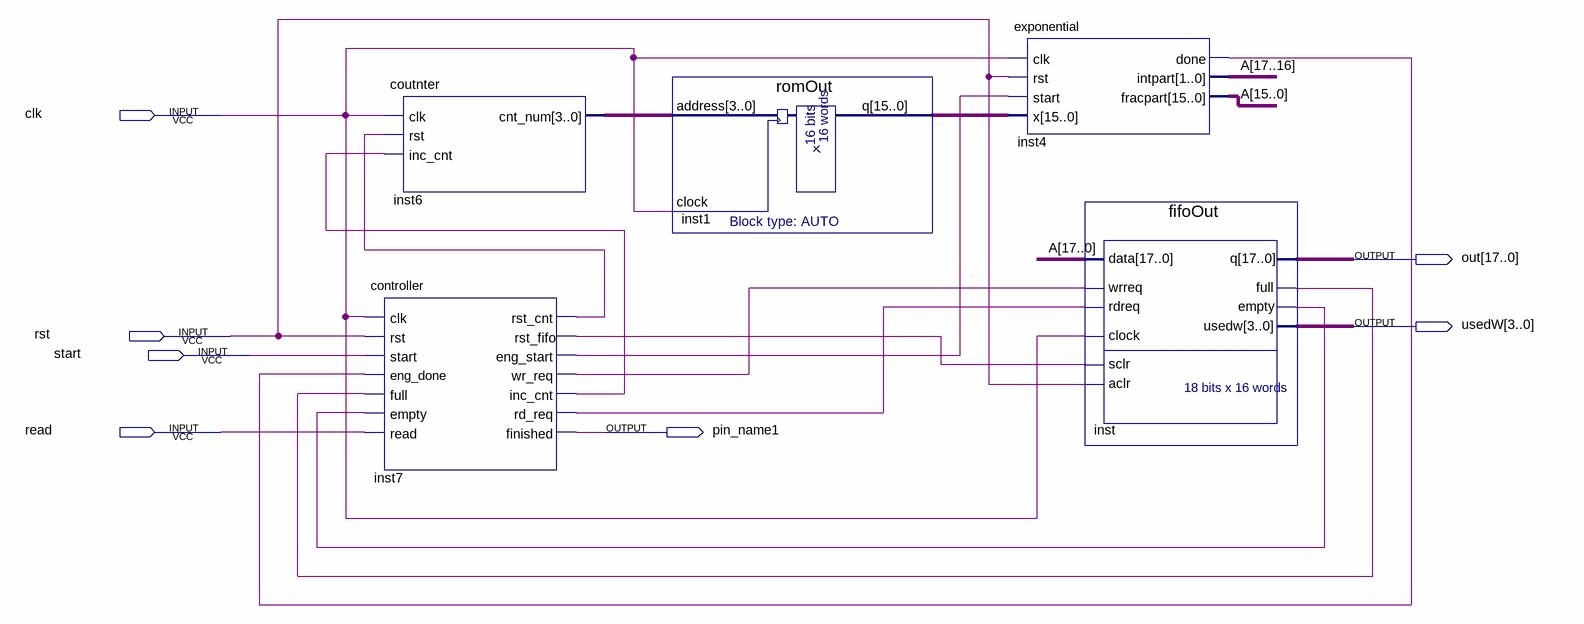
[diagram p0: schematic sheet]
// Quartus schematic exp.bdf as structural Verilog: 5 symbols, 7 pins
module exp (
  input  clk,
  input  rst,
  input  start,
  input  read,
  output [17:0] out,
  output [3:0] usedW,
  output pin_name1
);

  wire inst4_done, inst7_eng_start, inst7_inc_cnt, inst7_rd_req, inst7_rst_cnt, inst7_rst_fifo, inst7_wr_req,
       inst_empty, inst_full;
  wire [3:0] inst6_cnt_num;
  wire [15:0] inst1_q;
  wire [17:0] A;

  controller inst7 (
    .clk(clk), .rst(rst), .start(start), .eng_done(inst4_done), .full(inst_full), .empty(inst_empty),
    .read(read), .rst_cnt(inst7_rst_cnt), .rst_fifo(inst7_rst_fifo), .eng_start(inst7_eng_start),
    .wr_req(inst7_wr_req), .inc_cnt(inst7_inc_cnt), .rd_req(inst7_rd_req), .finished(pin_name1));
  coutnter inst6 (.clk(clk), .rst(inst7_rst_cnt), .inc_cnt(inst7_inc_cnt), .cnt_num(inst6_cnt_num));
  romOut inst1 (.address(inst6_cnt_num), .clock(clk), .q(inst1_q));
  exponential inst4 (
    .clk(clk), .rst(rst), .start(inst7_eng_start), .x(inst1_q), .done(inst4_done), .intpart(A[17:16]),
    .fracpart(A[15:0]));
  fifoOut inst (
    .data(A), .wrreq(inst7_wr_req), .rdreq(inst7_rd_req), .clock(clk), .sclr(inst7_rst_fifo), .aclr(rst),
    .q(out), .full(inst_full), .empty(inst_empty), .usedw(usedW));
endmodule
